# Altium schematic sheet Motor Driver Unit (MDU).SchDoc
size A; SheetNumber: 4; SheetTotal: 5
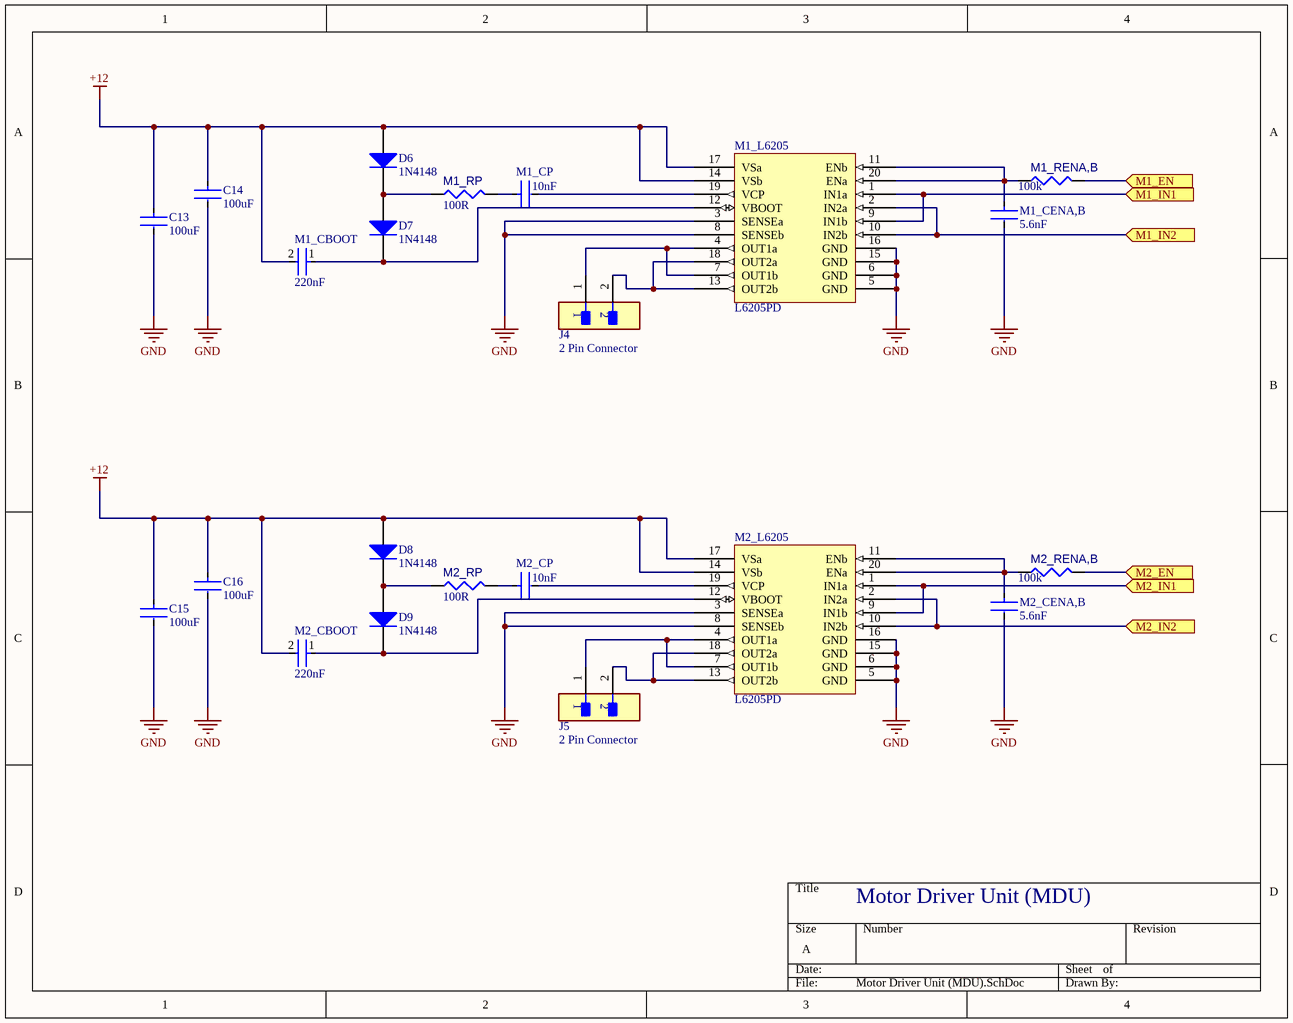
[diagram p0: Motor Driver Unit (MDU).SchDoc]

## Parts
C13  100uF  [FP-C3216-160-0_3-IPC_C]
C14  100uF  [FP-C3216-160-0_3-IPC_C]
C15  100uF  [FP-C3216-160-0_3-IPC_C]
C16  100uF  [FP-C3216-160-0_3-IPC_C]
D6  1N4148  [NXP-SOD27-2_V]
D7  1N4148  [NXP-SOD27-2_V]
D8  1N4148  [NXP-SOD27-2_V]
D9  1N4148  [NXP-SOD27-2_V]
J4  2 Pin Connector  [FP-53048-0210-MFG]
J5  2 Pin Connector  [FP-53048-0210-MFG]
M1_CBOOT  220nF  [FP-CL21-IPC_C]
M1_CENA,B  5.6nF  [FP-CC0603-DA-MFG]
M1_CP  10nF  [FP-CC0402-MFG]
M1_L6205  L6205PD  [SOJ127P870X356-20M]
M1_RENA,B  value 100k  [RESC1005X40X25ML05T05]  (hidden comment: Resistor 100k +/-1% 0402 100 mW)
M1_RP  value 100R  [RESC0402(1005)_L]  (hidden comment: 100R2F)
M2_CBOOT  220nF  [FP-CL21-IPC_C]
M2_CENA,B  5.6nF  [FP-CC0603-DA-MFG]
M2_CP  10nF  [FP-CC0402-MFG]
M2_L6205  L6205PD  [SOJ127P870X356-20M]
M2_RENA,B  value 100k  [RESC1005X40X25ML05T05]  (hidden comment: Resistor 100k +/-1% 0402 100 mW)
M2_RP  value 100R  [RESC0402(1005)_L]  (hidden comment: 100R2F)

## Ports
M1_EN (in), M1_IN1 (in), M1_IN2 (in), M2_EN (in), M2_IN1 (in), M2_IN2 (in)

## Nets
+12: C13.1 C14.1 C15.1 C16.1 D6.1(A) D8.1(A) M1_CBOOT.2 M1_L6205.14(VSb) M1_L6205.17(VSa) M2_CBOOT.2 M2_L6205.14(VSb) M2_L6205.17(VSa)
GND: C13.2 C14.2 C15.2 C16.2 M1_CENA,B.2 M1_L6205.3(SENSEa) M1_L6205.5(GND) M1_L6205.6(GND) M1_L6205.8(SENSEb) M1_L6205.15(GND) M1_L6205.16(GND) M2_CENA,B.2 M2_L6205.3(SENSEa) M2_L6205.5(GND) M2_L6205.6(GND) M2_L6205.8(SENSEb) M2_L6205.15(GND) M2_L6205.16(GND)
M1_EN: M1_RENA,B.2 ; port M1_EN
M1_IN1: M1_L6205.1(IN1a) M1_L6205.9(IN1b) ; port M1_IN1
M1_IN2: M1_L6205.2(IN2a) M1_L6205.10(IN2b) ; port M1_IN2
M2_EN: M2_RENA,B.2 ; port M2_EN
M2_IN1: M2_L6205.1(IN1a) M2_L6205.9(IN1b) ; port M2_IN1
M2_IN2: M2_L6205.2(IN2a) M2_L6205.10(IN2b) ; port M2_IN2
NetD6_2: D6.2(K) D7.1(A) M1_RP.1
NetD7_2: D7.2(K) M1_CBOOT.1 M1_L6205.12(VBOOT)
NetD8_2: D8.2(K) D9.1(A) M2_RP.1
NetD9_2: D9.2(K) M2_CBOOT.1 M2_L6205.12(VBOOT)
NetJ4_1: J4.1 M1_L6205.4(OUT1a) M1_L6205.7(OUT1b)
NetJ4_2: J4.2 M1_L6205.13(OUT2b) M1_L6205.18(OUT2a)
NetJ5_1: J5.1 M2_L6205.4(OUT1a) M2_L6205.7(OUT1b)
NetJ5_2: J5.2 M2_L6205.13(OUT2b) M2_L6205.18(OUT2a)
NetM1_CENA,B_1: M1_CENA,B.1 M1_L6205.11(ENb) M1_L6205.20(ENa) M1_RENA,B.1
NetM1_CP_1: M1_CP.1 M1_RP.2
NetM1_CP_2: M1_CP.2 M1_L6205.19(VCP)
NetM2_CENA,B_1: M2_CENA,B.1 M2_L6205.11(ENb) M2_L6205.20(ENa) M2_RENA,B.1
NetM2_CP_1: M2_CP.1 M2_RP.2
NetM2_CP_2: M2_CP.2 M2_L6205.19(VCP)

## Notes on the sheet
- Motor Driver Unit (MDU)

## Library data of the parts
C13-C16 = CMP-2000-05396-3: Multilayer Ceramic Capacitors 100uF ±20% 10V X5R SMD 1206; Voltage Rating (DC): 10V; Length: 3.2mm; Mount: Surface Mount; Depth: 1.6mm; Width: 1.6mm; Package Quantity: 1; Min Operating Temperature: -55°C; Packaging: Tape and Reel; Max Operating Temperature: 85°C; Dielectric: X5R; Construction: Flat; Case Code (Imperial): 1206; Capacitance: 100uF; Thickness: 0.075inch; Radiation Hardening: No; RoHS Compliant: Yes; Series: C; Dielectric Material: Ceramic; Voltage: 10V; REACH SVHC: No SVHC; Case Code (Metric): 3216; Weight: 0.000571oz; Height: 1.6mm; Voltage Rating: 10V; Termination: SMD/SMT; Lead Free: Lead Free; Tolerance: 20%; Case/Package: 1206; Resistor Type: Ceramic
D6-D9 = CMP-004-00000-2: High Speed Diode, 100 V, 0.45 A, -65 to 175 degC, 2-Pin SOD27, RoHS, Bulk; Manufacturer: Fairchild; Elements: 1; Recovery Time: 4ns; Forward Current: 300mA; Power: 500mW; Forward Voltage: 1V; Max Surge Current: 4A; Peak Reverse Current: 5uA; Datasheet URL: http://www.nxp.com/documents/data_sheet/1N4148_1N4448.pdf; Min Operating Temperature: -65°C; Manufacturer URL: https://www.fairchildsemi.com/; Packaging: Bulk; Diameter: 1.91mm; Pins: 2; Package URL: http://www.nxp.com/documents/data_sheet/1N4148_1N4448.pdf; Package Reference: SOD27; Max Operating Temperature: 175°C; Package Quantity: 2000; Case/Package: DO; Datasheet Version: Aug-04; RoHS Compliant: True
J4 J5 = CMP-04776-000546-1: CONN HEADER R/A 2POS 1.25MM; Number of Contacts: 2; Gender: Male; Contact Resistance: 20mR; Current Rating: 1A; Voltage Rating: 125V; Insulation Resistance: 100MR; Glow Wire Compliant: Non-compliant; Flammability Rating: UL94 V-0; Housing Color: Natural; Lead Free: Lead Free; Packaging: Tray; Max Operating Temperature: 85°C; Package Quantity: 5000; Housing Material: Nylon; Radiation Hardening: No; Series: PicoBlade; Termination: Through Hole; RoHS Compliant: Yes; Contact Material: Bronze; Number of Circuits: 2; Number of Rows: 1; Min Operating Temperature: -40°C; Mount: Through Hole; Number of Positions: 2; Pitch: 1.25mm; Voltage Rating (DC): 125V; Color: Natural; Orientation: Right Angle; Contact Plating: Tin
M1_CBOOT M2_CBOOT = CMP-13271-000053-1: CL21 Series 0805 220nF 25V ±10% Tolerance X7R Multilayer Ceramic Chip Capacitor; Width: 0.049inch; Lead Free: Lead Free; Length: 2mm; Capacitance: 220nF; Packaging: Tape and Reel; Depth: 1.25mm; Dielectric: X7R; Max Operating Temperature: 125°C; Tolerance: 10%; Min Operating Temperature: -55°C; Case Code (Metric): 2012; Package Quantity: 3000; Case/Package: 0805; Thickness: 0.053inch; Voltage Rating: 25V; Mount: Surface Mount; Case Code (Imperial): 0805; Radiation Hardening: No
M1_CENA,B M2_CENA,B = CMP-03422-001341-1: Surface Mount Ceramic Multilayer Capacitor 0.0056uF 10% X7R 50V 0603 Paper T/R; Manufacturer Part Number: CC0603KRX7R9BB562; Manufacturer: YAGEO; Tolerance: 0.1; Temperature Coefficient: 15%; Automotive: No; Category: Cap; RoHS: TRUE; Lead Free: Yes; Temperature Range Low: -55°C; Height: 0.9mm; Material: Ceramic; Device Class L3: Ceramic Capacitors; Digikey Description: Surface Mount Ceramic Multilayer Capacitor 0.0056uF 10% X7R 50V 0603 Paper T/R; Capacitance: 5.6 nF; Device Class L2: Capacitors; Voltage: 50 V; Temperature: -55°C to +125°C; Octopart: https://octopart.com/cc0603krx7r9bb562-yageo-42336084; Package: CC0603-DA; ComponentLink2URL: http://www.yageo.com/documents/recent/UPY-GPHC_X7R_6.3V-to-50V_18.pdf; Device Class L1: Passive Components; Mouser Description: Multilayer Ceramic Capacitors MLCC - SMD/SMT 5.6nF 50V X7R 10%; Temperature Characteristic: X7R; Value: 5.6 nF; Temperature Range High: +125°C; Voltage Rating: 50 V; ComponentLink2Description: Datasheet; Footprint Url: http://www.yageo.com/exep/pages/download/literatures/UPY-C_GEN_24.pdf
M1_CP M2_CP = CMP-2100-03592-2: CAP CER 10000PF 50V X7R 0402; Manufacturer Part Number: CC0402KRX7R9BB103; Manufacturer: YAGEO; Temperature Coefficient: 30ppm/°C; Automotive Grade: NA; Tolerance: 0.1; Device Class L3: Ceramic Capacitors; Temperature: -55°C to +125°C; Footprint Url: http://www.yageo.com/exep/pages/download/literatures/UPY-C_GEN_24.pdf; Ipc Land Pattern Name: CAPC10050X50; Device Class L1: Passive Components; Automotive: No; Octopart: https://octopart.com/cc0402krx7r9bb103-yageo-8376513; Lead Free: Yes; Temperature Range Low: -55°C; Height: 0.55mm; ComponentLink2URL: http://www.yageo.com/documents/recent/UPY-GP_NP0_16V-to-50V_16.pdf; Capacitance: 10 nF; Category: Cap; Material: Ceramic; ComponentLink2Description: Datasheet; Temperature Range High: +125°C; Digikey Description: CAP CER 10000PF 50V X7R 0402; Voltage Rating: 50 V; Package: CC0402; Device Class L2: Capacitors; Mouser Description: 0402 10 nF 50 V ±10 % Tolerance X7R SMT Multilayer Ceramic Capacitor; Value: 10 nF; RoHS: TRUE; Temperature Characteristic: X7R
M1_L6205 M2_L6205 = CMP-00024-00006-1: Stepper Motor Controller, 5.6A, BCDMOS, PDSO20; Nominal Supply Voltage: 48V; Max Operating Temperature: 150°C; Case/Package: HSOP; Min Operating Temperature: -40°C; Pins: 20; RoHS Compliant: Yes
M1_RENA,B M2_RENA,B = CMP-009-00022-5: Chip Resistor, 100 KOhm, +/- 1%, 0.1 W, -55 to 155 degC, 0402 (1005 Metric); Power: 100mW; Voltage Rating: 50V; Mounting Technology: SM; Pins: 2; Min Operating Temperature: -55°C; Tolerance: 1%; RoHS Compliant: True; Case/Package: 0402; Max Operating Temperature: 155°C
M1_RP M2_RP = CMP-009-00065-2: 100R 0.063W 1% 0402 (1005 Metric)  SMD; Power: 63mW; Tolerance: 1%; Case/Package: 0402; Pins: 2; Mounting Technology: SMT